# EAGLE design bldc (EAGLE 9.6.2)
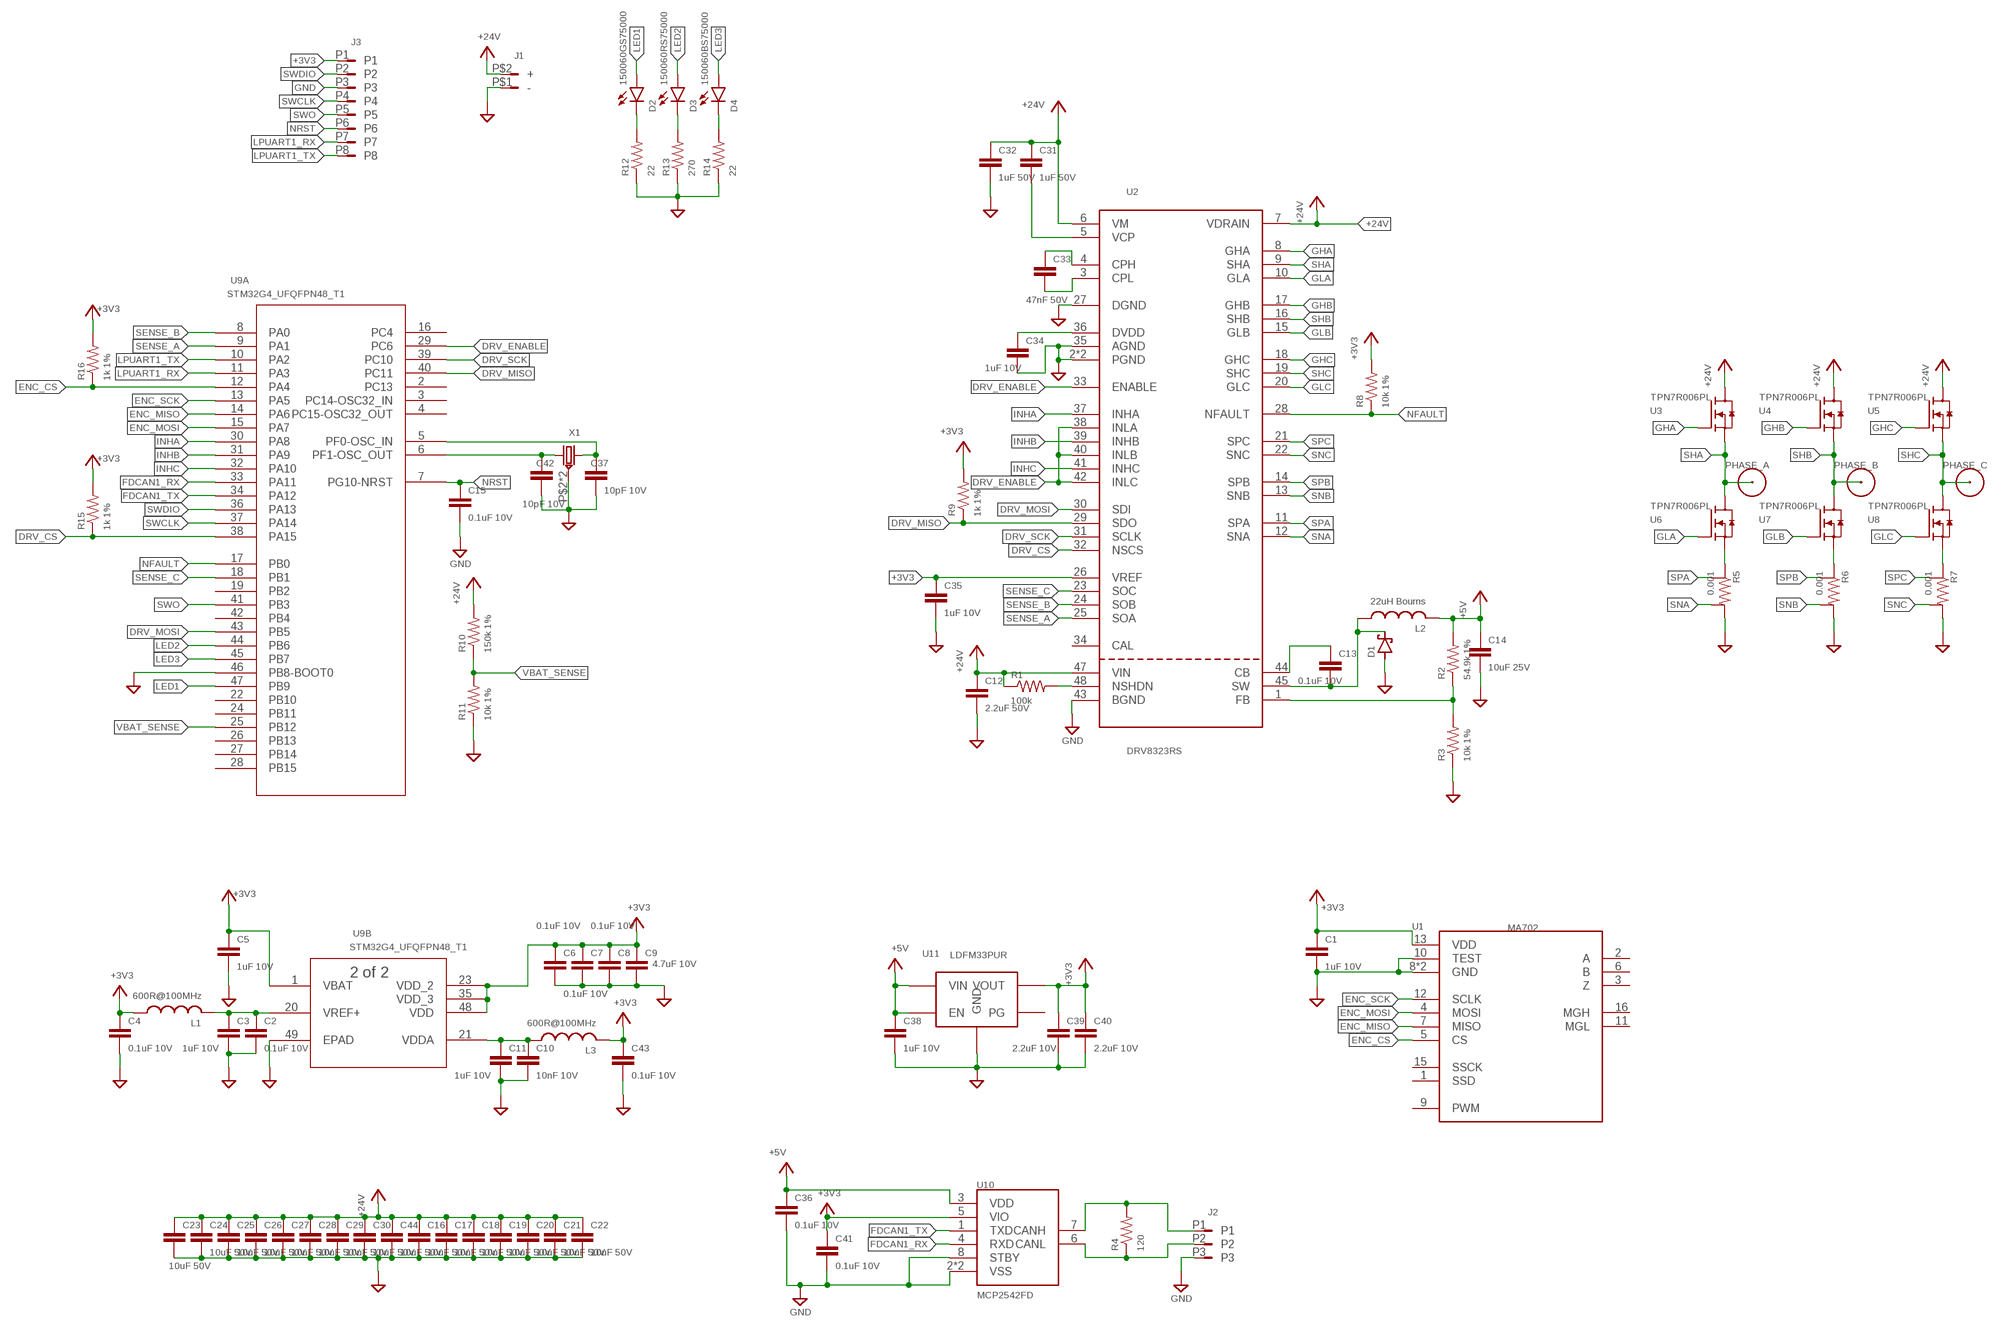
[diagram p0: schematic, sheet 1]

## Parts
C1  1uF 10V  C0402  [C0402]
C2  0.1uF 10V  C0402  [C0402]
C3  1uF 10V  C0402  [C0402]
C4  0.1uF 10V  C0402  [C0402]
C5  1uF 10V  C0402  [C0402]
C6  0.1uF 10V  C0402  [C0402]
C7  0.1uF 10V  C0402  [C0402]
C8  0.1uF 10V  C0402  [C0402]
C9  4.7uF 10V  C0402  [C0402]
C10  10nF 10V  C0402  [C0402]
C11  1uF 10V  C0402  [C0402]
C12  2.2uF 50V  C0603  [C0603]
C13  0.1uF 10V  C0402  [C0402]
C14  10uF 25V  C0603  [C0603]
C15  0.1uF 10V  C0402  [C0402]
C16  10uF 50V  C1206  [C1206]
C17  10uF 50V  C1206  [C1206]
C18  10uF 50V  C1206  [C1206]
C19  10uF 50V  C1206  [C1206]
C20  10uF 50V  C1206  [C1206]
C21  10uF 50V  C1206  [C1206]
C22  10uF 50V  C1206  [C1206]
C23  10uF 50V  C1206  [C1206]
C24  10uF 50V  C1206  [C1206]
C25  10uF 50V  C1206  [C1206]
C26  10uF 50V  C1206  [C1206]
C27  10uF 50V  C1206  [C1206]
C28  10uF 50V  C1206  [C1206]
C29  10uF 50V  C1206  [C1206]
C30  10uF 50V  C1206  [C1206]
C31  1uF 50V  C0603  [C0603]
C32  1uF 50V  C0603  [C0603]
C33  47nF 50V  C0402  [C0402]
C34  1uF 10V  C0402  [C0402]
C35  1uF 10V  C0402  [C0402]
C36  0.1uF 10V  C0402  [C0402]
C37  10pF 10V  C0402  [C0402]
C38  1uF 10V  C0402  [C0402]
C39  2.2uF 10V  C0402  [C0402]
C40  2.2uF 10V  C0402  [C0402]
C41  0.1uF 10V  C0402  [C0402]
C42  10pF 10V  C0402  [C0402]
C43  0.1uF 10V  C0402  [C0402]
C44  10uF 50V  C1206  [C1206]
D1  SCHOTTKY_SOD123  [SOD123]
D2  150060GS75000  LED_0603  [D0603]
D3  150060RS75000  LED_0603  [D0603]
D4  150060BS75000  LED_0603  [D0603]
J1  PWR_2_XT30PW-M  [XT30PW-M]
J2  LINEAR_35040500391  [MOLEX_5040500391]
J3  LINEAR_8530480810  [MOLEX_530480810]
L1  600R@100MHz  DC_CHOKE_FERRITE_BEAD_0603  [L0603]
L2  22uH Bourns  L_SDR0302  [SDR0302]
L3  600R@100MHz  DC_CHOKE_FERRITE_BEAD_0603  [L0603]
PHASE_A  WIRE_HOLE_AWG_18  [AWG_18]
PHASE_B  WIRE_HOLE_AWG_18  [AWG_18]
PHASE_C  WIRE_HOLE_AWG_18  [AWG_18]
R1  100k  R0402  [R0402]
R2  54.9k 1%  R0402  [R0402]
R3  10k 1%  R0402  [R0402]
R4  120  R0402  [R0402]
R5  0.001  R_SENSE_1210  [R1210_KELVIN]
R6  0.001  R_SENSE_1210  [R1210_KELVIN]
R7  0.001  R_SENSE_1210  [R1210_KELVIN]
R8  10k 1%  R0402  [R0402]
R9  1k 1%  R0402  [R0402]
R10  150k 1%  R0402  [R0402]
R11  10k 1%  R0402  [R0402]
R12  22  R0402  [R0402]
R13  270  R0402  [R0402]
R14  22  R0402  [R0402]
R15  1k 1%  R0402  [R0402]
R16  1k 1%  R0402  [R0402]
U1  MA702  [QFN-16_3X3]
U2  DRV8323RS  [VQFN-48_7X7]
U3  TPN7R006PL  [2-3X1S-TSONADVANCE]
U4  TPN7R006PL  [2-3X1S-TSONADVANCE]
U5  TPN7R006PL  [2-3X1S-TSONADVANCE]
U6  TPN7R006PL  [2-3X1S-TSONADVANCE]
U7  TPN7R006PL  [2-3X1S-TSONADVANCE]
U8  TPN7R006PL  [2-3X1S-TSONADVANCE]
U9  STM32G4_UFQFPN48_T1  [UFQFPN-48_7X7X0P55MM]
U10  MCP2542FD  [TDFN_2X3]
U11  LDFM33PUR  [DFN6_2X2]
X1  CRYSTAL_NX2016SA-24MHZ-EXS00A-CS11335  [NX201SA]

## Nets
3.3V30MA: C34.1 U2.36(DVDD)
+3V3 [midcurrent]: C1.1 C4.1 C5.1 C6.1 C7.1 C8.1 C9.1 C35.1 C39.1 C40.1 C41.1 C43.1 J3.P1 L1.1 L3.2 R8.2 R9.2 R15.2 R16.2 U1.13(VDD) U2.26(VREF) U9.1(B:VBAT) U9.23(B:VDD_2) U9.35(B:VDD_3) U9.48(B:VDD) U10.5(VIO) U11.PIN1(VOUT)
+5V [midcurrent]: C14.1 C36.1 C38.1 L2.PIN2 R2.2 U10.3(VDD) U11.PIN5(EN) U11.PIN6(VIN)
+24V [HighCurrent]: C12.1 C16.1 C17.1 C18.1 C19.1 C20.1 C21.1 C22.1 C23.1 C24.1 C25.1 C26.1 C27.1 C28.1 C29.1 C30.1 C31.1 C32.1 C44.1 J1.P$2(+) R1.1 R10.2 U2.6(VM) U2.7(VDRAIN) U2.47(VIN) U3.DRAIN(D) U4.DRAIN(D) U5.DRAIN(D)
DRV_CS: R15.1 U2.32(NSCS) U9.38(A:PA15)
DRV_ENABLE: U2.33(ENABLE) U2.38(INLA) U2.40(INLB) U2.42(INLC) U9.29(A:PC6)
DRV_MISO: R9.1 U2.29(SDO) U9.40(A:PC11)
DRV_MOSI: U2.30(SDI) U9.43(A:PB5)
DRV_SCK: U2.31(SCLK) U9.39(A:PC10)
ENC_CS: R16.1 U1.5(CS) U9.12(A:PA4)
ENC_MISO: U1.7(MISO) U9.14(A:PA6)
ENC_MOSI: U1.4(MOSI) U9.15(A:PA7)
ENC_SCK: U1.12(SCLK) U9.13(A:PA5)
FDCAN1_RX: U9.33(A:PA11) U10.4(RXD)
FDCAN1_TX: U9.34(A:PA12) U10.1(TXD)
GHA: U2.8(GHA) U3.GATE(G)
GHB: U2.17(GHB) U4.GATE(G)
GHC: U2.18(GHC) U5.GATE(G)
GLA: U2.10(GLA) U6.GATE(G)
GLB: U2.15(GLB) U7.GATE(G)
GLC: U2.20(GLC) U8.GATE(G)
GND: C1.2 C2.2 C3.2 C4.2 C5.2 C6.2 C7.2 C8.2 C9.2 C10.2 C11.2 C12.2 C14.2 C15.2 C16.2 C17.2 C18.2 C19.2 C20.2 C21.2 C22.2 C23.2 C24.2 C25.2 C26.2 C27.2 C28.2 C29.2 C30.2 C32.2 C34.2 C35.2 C36.2 C37.2 C38.2 C39.2 C40.2 C41.2 C42.2 C43.2 C44.2 D1.A J1.P$1(-) J2.P3 J3.P3 R3.1 R5.2A R5.2B R6.2A R6.2B R7.2A R7.2B R11.1 R12.1 R13.1 R14.1 U1.8(GND) U1.10(TEST) U1.PAD(GND) U2.2(PGND) U2.27(DGND) U2.35(AGND) U2.43(BGND) U2.PAD(PGND) U9.46(A:PB8-BOOT0) U9.49(B:EPAD) U10.2(VSS) U10.8(STBY) U10.PAD(VSS) U11.PAD(GND) U11.PIN4(GND) X1.P$2(GND) X1.P$4(GND)
INHA: U2.37(INHA) U9.30(A:PA8)
INHB: U2.39(INHB) U9.31(A:PA9)
INHC: U2.41(INHC) U9.32(A:PA10)
LED1: D2.2(A) U9.47(A:PB9)
LED2: D3.2(A) U9.44(A:PB6)
LED3: D4.2(A) U9.45(A:PB7)
LPUART1_RX: J3.P7 U9.11(A:PA3)
LPUART1_TX: J3.P8 U9.10(A:PA2)
N$1: C2.1 C3.1 L1.2 U9.20(B:VREF+)
N$2: C37.1 U9.5(A:PF0-OSC_IN) X1.P$3
N$3: C42.1 U9.6(A:PF1-OSC_OUT) X1.P$1
N$4: D4.1(C) R14.2
N$5: R1.2 U2.48(NSHDN)
N$6: C13.1 U2.44(CB)
N$7: D3.1(C) R13.2
N$8 [HighCurrent]: C13.2 D1.C L2.PIN1 U2.45(SW)
N$9: R2.1 R3.2 U2.1(FB)
N$10: D2.1(C) R12.2
N$11: J2.P1 R4.2 U10.7(CANH)
N$12: J2.P2 R4.1 U10.6(CANL)
N$13: C31.2 U2.5(VCP)
N$14: C33.1 U2.4(CPH)
N$15: C33.2 U2.3(CPL)
N$16 [midcurrent]: C10.1 C11.1 L3.1 U9.21(B:VDDA)
N$21: R7.1A R7.1B U8.SOURCE(S) U8.SOURCE@1(S) U8.SOURCE@2(S)
N$22: R6.1A R6.1B U7.SOURCE(S) U7.SOURCE@1(S) U7.SOURCE@2(S)
N$23: R5.1A R5.1B U6.SOURCE(S) U6.SOURCE@1(S) U6.SOURCE@2(S)
NFAULT: R8.1 U2.28(NFAULT) U9.17(A:PB0)
NRST: C15.1 J3.P6 U9.7(A:PG10-NRST)
SENSE_A: U2.25(SOA) U9.9(A:PA1)
SENSE_B: U2.24(SOB) U9.8(A:PA0)
SENSE_C: U2.23(SOC) U9.18(A:PB1)
SHA: PHASE_A.PIN1(P1) U2.9(SHA) U3.SOURCE(S) U3.SOURCE@1(S) U3.SOURCE@2(S) U6.DRAIN(D)
SHB: PHASE_B.PIN1(P1) U2.16(SHB) U4.SOURCE(S) U4.SOURCE@1(S) U4.SOURCE@2(S) U7.DRAIN(D)
SHC: PHASE_C.PIN1(P1) U2.19(SHC) U5.SOURCE(S) U5.SOURCE@1(S) U5.SOURCE@2(S) U8.DRAIN(D)
SNA: R5.2_KELVIN(K2) U2.12(SNA)
SNB: R6.2_KELVIN(K2) U2.13(SNB)
SNC: R7.2_KELVIN(K2) U2.22(SNC)
SPA: R5.1_KELVIN(K1) U2.11(SPA)
SPB: R6.1_KELVIN(K1) U2.14(SPB)
SPC: R7.1_KELVIN(K1) U2.21(SPC)
SWCLK: J3.P4 U9.37(A:PA14)
SWDIO: J3.P2 U9.36(A:PA13)
SWO: J3.P5 U9.41(A:PB3)
VBAT_SENSE: R10.1 R11.2 U9.25(A:PB12)
Unconnected: J1.P$3(GND) J1.P$4(GND) J2.MNT@1(GND) J2.MNT@2(GND) U1.1(SSD) U1.2(A) U1.3(Z) U1.6(B) U1.9(PWM) U1.11(MGL) U1.14(NC) U1.15(SSCK) U1.16(MGH) U2.34(CAL) U2.46(NC) U9.2(A:PC13) U9.3(A:PC14-OSC32_IN) U9.4(A:PC15-OSC32_OUT) U9.16(A:PC4) U9.19(A:PB2) U9.22(A:PB10) U9.24(A:PB11) U9.26(A:PB13) U9.27(A:PB14) U9.28(A:PB15) U9.42(A:PB4) U11.PIN3(PG)

## Library data of the parts
C1-C43 = _T_rcl:C
C44 = _T_rcl:C; BOM: C3216X7R1H106K160AE
D1 = _T_rcl:SCHOTTKY
D2-D4 = _T_rcl:LED
J1 = _T_conn:PWR_2
J2 = _T_conn:LINEAR_3
J3 = _T_conn:LINEAR_8
L1 L3 = _T_rcl:DC_CHOKE
L2 = _T_rcl:L
PHASE_A PHASE_B PHASE_C = _T_conn:WIRE_HOLE
R1-R4 R8-R16 = _T_rcl:R
R5-R7 = _T_rcl:R_SENSE
U1 = _T_ic:MA702; DATASHEET: https://www.monolithicpower.com/en/documentview/productdocument/index/version/2/document_type/Datasheet/lang/en/sku/MA702/
U2 = _T_ic:DRV8323RS; DATASHEET: https://www.ti.com/lit/ds/symlink/drv8323r.pdf?ts=1587957100782
U3-U8 = _T_transistors:TPN7R006PL
U9 = _T_ic:STM32G4_UFQFPN48_T1; BUILT_BY: EMA_Jessica; COPYRIGHT: Copyright (C) 2016 Accelerated Designs. All rights reserved; MANUFACTURER_PART_NUMBER: stm32g4_ufqfpn48_t1; VENDOR: STMicroelectronics
U10 = _T_ic:MCP2542FD
U11 = _T_ic:LDFM
X1 = _T_ic:CRYSTAL

## Net classes
0 default: width 0.2 mm, drill 0.3 mm, clearance 0.152 mm
1 Smallsig: width 0.2 mm, drill 0.3 mm, clearance 0.152 mm
2 HighCurrent: width 0.35 mm, drill 0.3 mm, clearance 0.203 mm
3 midcurrent: width 0.25 mm, drill 0.3 mm, clearance 0.178 mm

## Board
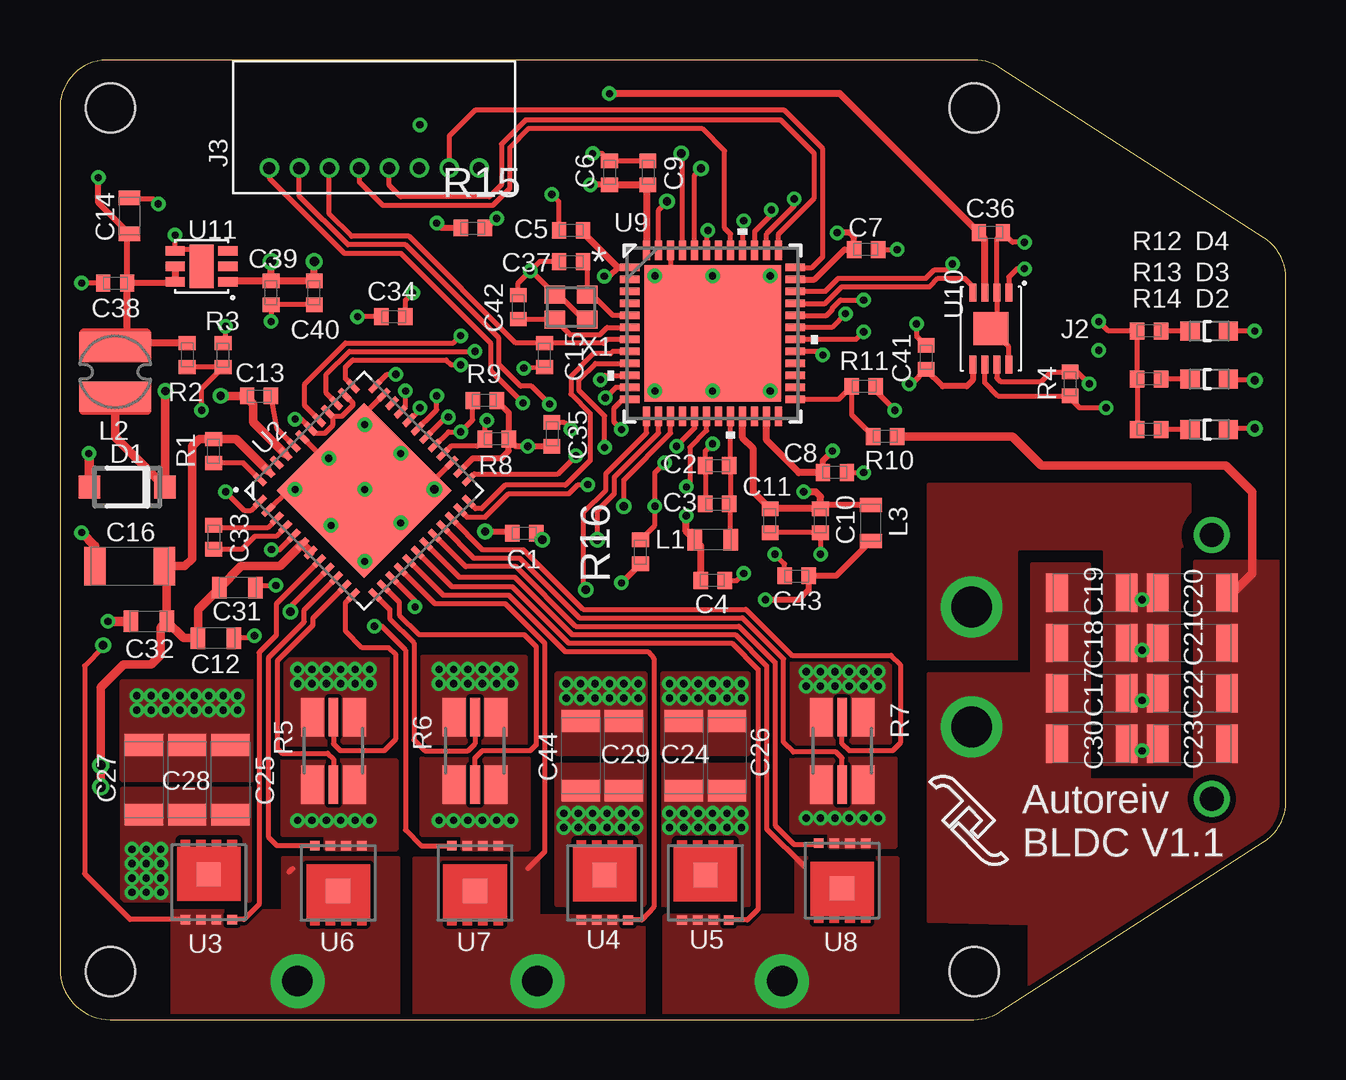
[diagram p1: board, top side]
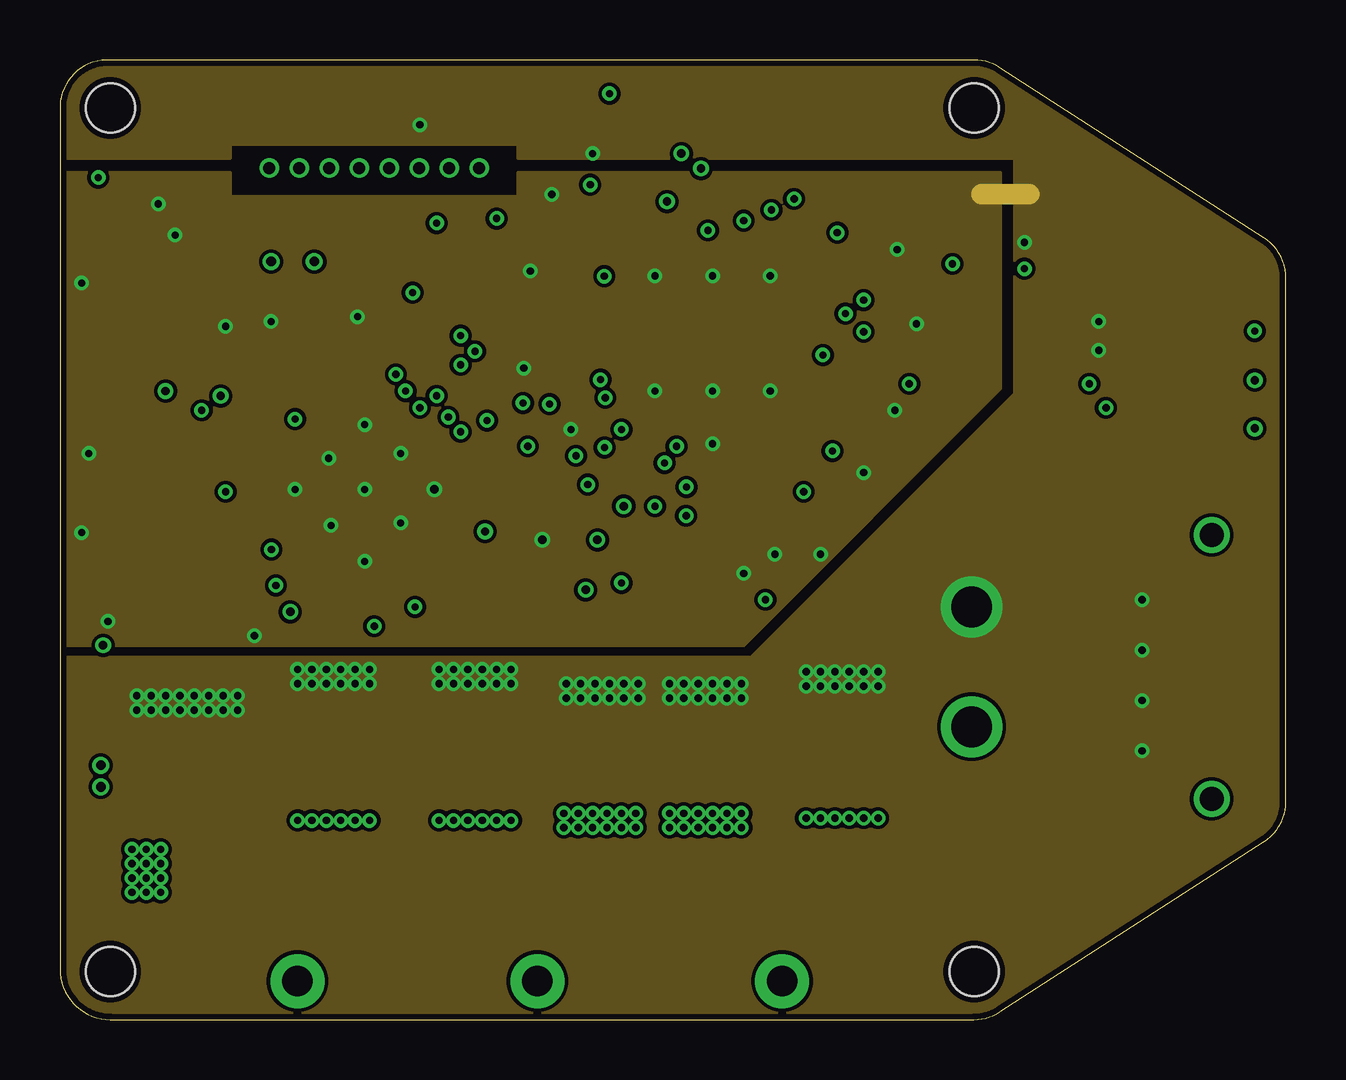
[diagram p2: board, inner layer Route2]
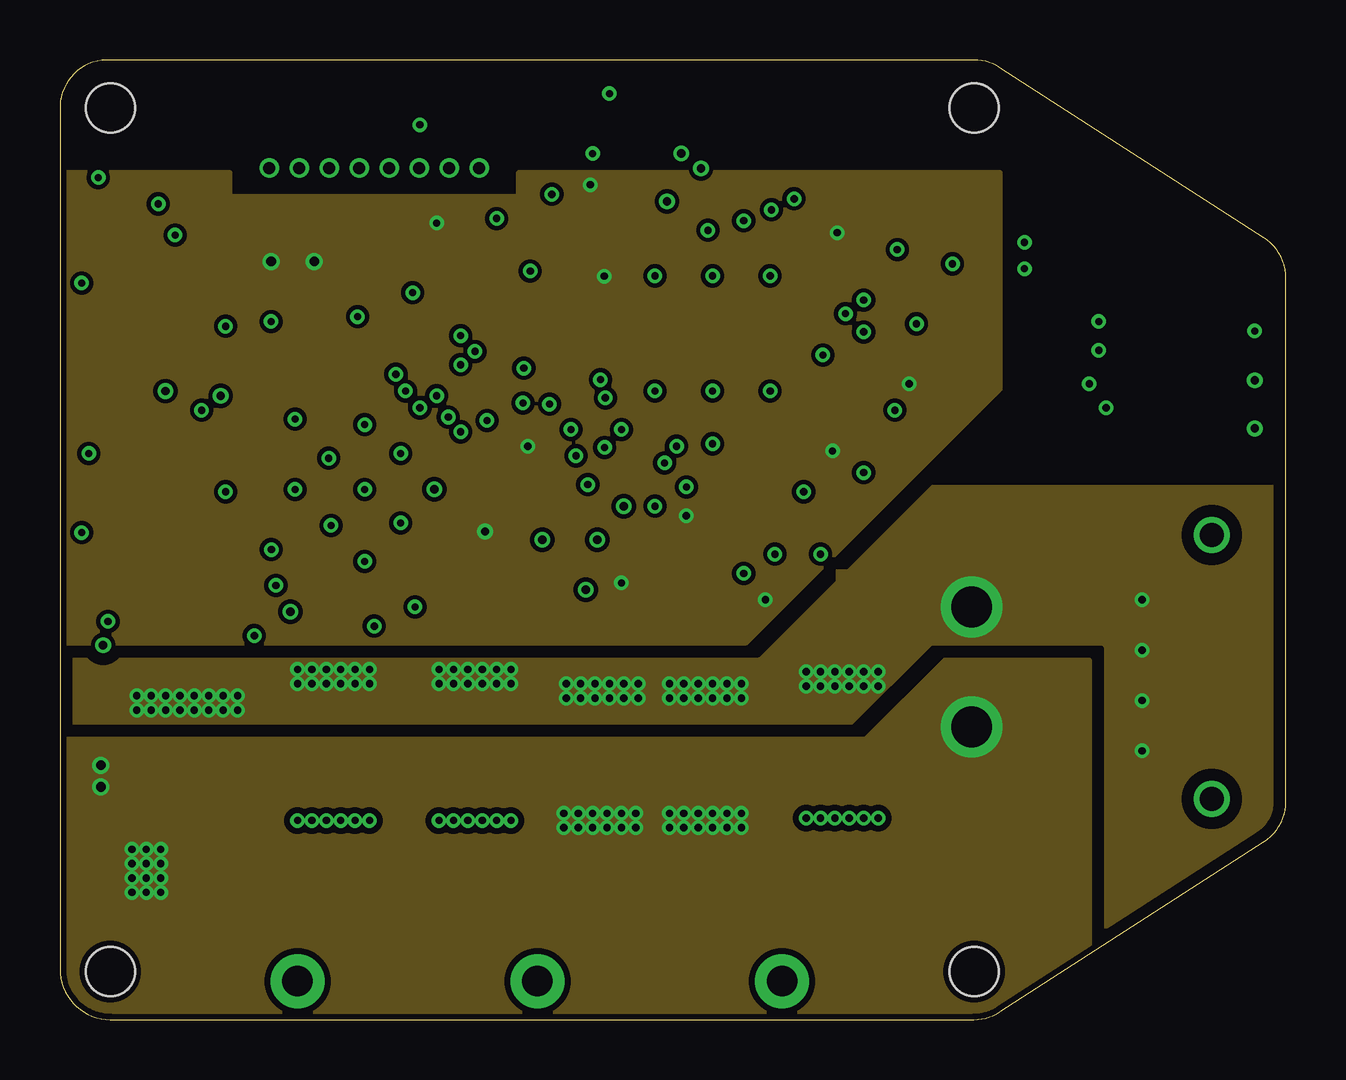
[diagram p3: board, inner layer Route15]
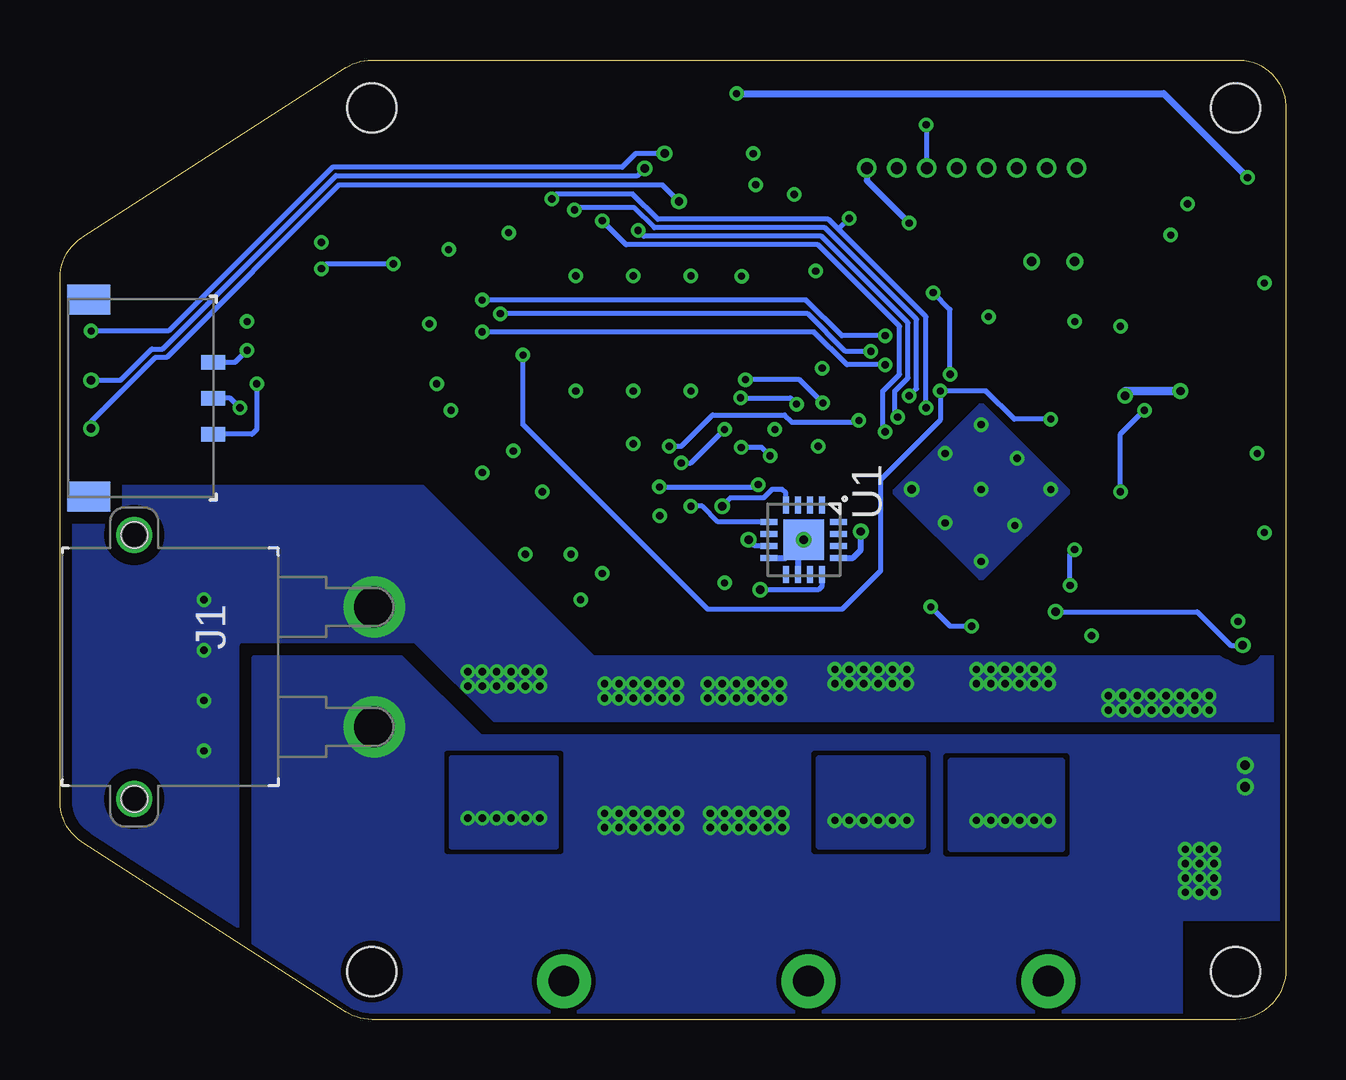
[diagram p4: board, bottom side, seen from below]

Size 51.1 x 40 mm. Coordinates in mm from the lower left corner, seen from the top.
Outline: 39.18,39.68 arc33 38.1,40 2.1,40 arc90 0,38.1 0,2.1 arc90 2.1,0 38.1,0 arc33 39.18,0.32 50.18,7.41 arc57 51.1,9.09 51.1,30.91 arc57 50.18,32.59 39.18,39.68
Copper layers (1*2*15*16): Top 0.035mm / dielectric 0.11mm / Route2 0.035mm / dielectric 1.31mm / Route15 0.035mm / dielectric 0.11mm / Bottom 0.035mm
Design rules "pcbway_4_layer *": minimum track width 6mil, minimum drill 0.29mm, track to track 6mil, track to pad 6mil, pad to pad 6mil, via to via 6mil, smd to smd 0mil, copper to edge 0.25mm, drill to drill 10mil, minimum pad ring 6mil, minimum via ring 6mil, stop-mask expansion 2mil, vias tented up to drill 0mil, thermal gap 10mil
Holes 2.05 mm at 2.1,38 38.1,38 38.1,2 2.1,2

### Footprints (pad centres in the part's own frame; a part is rotated, then mirrored left to right if it is on the bottom)
C0402 = smd 0.6 x 0.7: 1 0.5,0; 2 -0.5,0
C0603 = smd 0.6 x 0.9: 1 0.75,0; 2 -0.75,0
C1206 = smd 0.9 x 1.6: 1 1.45,0; 2 -1.45,0
SOD123 = smd 0.9 x 0.95: A 1.575,0; C -1.575,0
D0603 = smd 0.8 x 0.8: 1 -0.8,0; 2 0.8,0
XT30PW-M = drill 1.7: P$1 -2.5,10; P$2 2.5,10 | drill 1: P$3 5.5,0; P$4 -5.5,0
MOLEX_5040500391 = smd 1.25 x 1.8: MNT@1 4.105,5.2; MNT@2 -4.105,5.2 | smd 0.6 x 1: P1 -1.5,0.01; P2 0,0.01; P3 1.5,0.01
MOLEX_530480810 = drill 0.5: P1 4.375,0; P2 3.125,0; P3 1.875,0; P4 0.625,0; P5 -0.625,0; P6 -1.875,0; P7 -3.125,0; P8 -4.375,0
L0603 = smd 0.6 x 0.9: 1 0.75,0; 2 -0.75,0
SDR0302 = smd 3 x 1.25: PIN1 0,1.025; PIN2 0,-1.025
AWG_18 = drill 1.28 pad 2.25: PIN1 0,0
R0402 = smd 0.6 x 0.7: 1 0.5,0; 2 -0.5,0
R1210_KELVIN = smd 1.6 x 0.4: 1_KELVIN -1.4,0; 2_KELVIN 1.4,0 | smd 1.6 x 0.95: 1A -1.4,0.875; 1B -1.4,-0.875; 2A 1.4,0.875; 2B 1.4,-0.875
QFN-16_3X3 = smd 0.7 x 0.25: 1 -1.45,0.75; 2 -1.45,0.25; 3 -1.45,-0.25; 4 -1.45,-0.75; 9 1.45,-0.75; 10 1.45,-0.25; 11 1.45,0.25; 12 1.45,0.75 | smd 0.25 x 0.7: 5 -0.75,-1.45; 6 -0.25,-1.45; 7 0.25,-1.45; 8 0.75,-1.45; 13 0.75,1.45; 14 0.25,1.45; 15 -0.25,1.45; 16 -0.75,1.45 | smd 1.7 x 1.7: PAD 0,0
VQFN-48_7X7 = smd 0.6 x 0.24: 1 -3.4,2.75; 2 -3.4,2.25; 3 -3.4,1.75; 4 -3.4,1.25; 5 -3.4,0.75; 6 -3.4,0.25; 7 -3.4,-0.25; 8 -3.4,-0.75; 9 -3.4,-1.25; 10 -3.4,-1.75; 11 -3.4,-2.25; 12 -3.4,-2.75; 25 3.4,-2.75; 26 3.4,-2.25; 27 3.4,-1.75; 28 3.4,-1.25; 29 3.4,-0.75; 30 3.4,-0.25; 31 3.4,0.25; 32 3.4,0.75; 33 3.4,1.25; 34 3.4,1.75; 35 3.4,2.25; 36 3.4,2.75 | smd 0.24 x 0.6: 13 -2.75,-3.4; 14 -2.25,-3.4; 15 -1.75,-3.4; 16 -1.25,-3.4; 17 -0.75,-3.4; 18 -0.25,-3.4; 19 0.25,-3.4; 20 0.75,-3.4; 21 1.25,-3.4; 22 1.75,-3.4; 23 2.25,-3.4; 24 2.75,-3.4; 37 2.75,3.4; 38 2.25,3.4; 39 1.75,3.4; 40 1.25,3.4; 41 0.75,3.4; 42 0.25,3.4; 43 -0.25,3.4; 44 -0.75,3.4; 45 -1.25,3.4; 46 -1.75,3.4; 47 -2.25,3.4; 48 -2.75,3.4 | smd 5.15 x 5.15: PAD 0,0
2-3X1S-TSONADVANCE = smd 1 x 1: DRAIN 0.005,0.33 | smd 0.4 x 0.4: GATE 0.975,-1.55; SOURCE -0.975,-1.55; SOURCE@1 -0.325,-1.55; SOURCE@2 0.325,-1.55
UFQFPN-48_7X7X0P55MM = smd 0.813 x 0.305: 1 -3.454,2.75; 2 -3.454,2.25; 3 -3.454,1.75; 4 -3.454,1.25; 5 -3.454,0.75; 6 -3.454,0.25; 7 -3.454,-0.25; 8 -3.454,-0.75; 9 -3.454,-1.25; 10 -3.454,-1.75; 11 -3.454,-2.25; 12 -3.454,-2.75; 25 3.454,-2.75; 26 3.454,-2.25; 27 3.454,-1.75; 28 3.454,-1.25; 29 3.454,-0.75; 30 3.454,-0.25; 31 3.454,0.25; 32 3.454,0.75; 33 3.454,1.25; 34 3.454,1.75; 35 3.454,2.25; 36 3.454,2.75 | smd 0.305 x 0.813: 13 -2.75,-3.454; 14 -2.25,-3.454; 15 -1.75,-3.454; 16 -1.25,-3.454; 17 -0.75,-3.454; 18 -0.25,-3.454; 19 0.25,-3.454; 20 0.75,-3.454; 21 1.25,-3.454; 22 1.75,-3.454; 23 2.25,-3.454; 24 2.75,-3.454; 37 2.75,3.454; 38 2.25,3.454; 39 1.75,3.454; 40 1.25,3.454; 41 0.75,3.454; 42 0.25,3.454; 43 -0.25,3.454; 44 -0.75,3.454; 45 -1.25,3.454; 46 -1.75,3.454; 47 -2.25,3.454; 48 -2.75,3.454 | smd 5.69 x 5.69: 49 0,0
TDFN_2X3 = smd 0.3 x 0.75: 1 -0.75,-1.5; 2 -0.25,-1.5; 3 0.25,-1.5; 4 0.75,-1.5; 5 0.75,1.5; 6 0.25,1.5; 7 -0.25,1.5; 8 -0.75,1.5 | smd 1.46 x 1.36: PAD 0,0
DFN6_2X2 = smd 1.8 x 1: PAD 0,0 | smd 0.4 x 0.8: PIN1 0.65,1.1; PIN2 0,1.1; PIN3 -0.65,1.1; PIN4 -0.65,-1.1; PIN5 0,-1.1; PIN6 0.65,-1.1
NX201SA = smd 0.85 x 0.75: P$1 -0.675,-0.525; P$2 0.675,-0.525; P$3 0.675,0.525; P$4 -0.675,0.525

### Placement (x,y rotation side)
C1  19.36,20.27 180 top
C2  27.4,23.1 0 top
C3  27.4,21.5 0 top
C4  27.2,18.3 180 top
C5  21.3,32.9 0 top
C6  22.9,35.3 270 top
C7  33.6,32.1 180 top
C8  32.3,22.8 180 top
C9  24.5,35.3 270 top
C10  31.7,20.8 90 top
C11  29.6,20.8 90 top
C12  6.5,15.9 180 top
C13  8.3,26 0 top
C14  2.9,33.5 270 top
C15  20.2,27.7 90 top
C16  2.9,18.9 0 top
C17  43,13.6 180 top
C18  43,15.7 180 top
C19  43,17.8 180 top
C20  47.2,17.8 0 top
C21  47.2,15.7 0 top
C22  47.2,13.6 0 top
C23  47.2,11.5 0 top
C24  26,11 270 top
C25  7.1,10 270 top
C26  27.8,11 270 top
C27  3.5,10 270 top
C28  5.3,10 270 top
C29  23.5,11 270 top
C30  43,11.5 180 top
C31  7.4,18 180 top
C32  3.7,16.6 0 top
C33  6.4,20.1 270 top
C34  13.9,29.3 0 top
C35  20.5,24.4 270 top
C36  38.8,32.8 180 top
C37  21.3,31.6 0 top
C38  2.3,30.7 0 top
C39  8.8,30.3 90 top
C40  10.6,30.3 90 top
C41  36.1,27.6 270 top
C42  19.1,29.7 270 top
C43  30.7,18.5 0 top
C44  21.7,11 270 top
D1  2.8,22.2 180 top
D2  47.9,24.6 0 top
D3  47.9,26.7 0 top
D4  47.9,28.7 0 top
J1  48,14.7 270 bottom
J2  44.7,25.9 90 bottom
J3  13.1,35.5 0 top
L1  27.2,20 180 top
L2  2.3,27 180 top
L3  33.8,20.7 90 top
PHASE_A  9.9,1.6 0 top
PHASE_B  19.9,1.6 0 top
PHASE_C  30.1,1.6 0 top
R1  6.4,23.7 90 top
R2  5.3,27.7 270 top
R3  6.8,27.7 90 top
R4  42.1,26.5 270 top
R5  11.4,11.2 90 top
R6  17.3,11.2 90 top
R7  32.6,11.2 90 top
R8  18.2,24.2 180 top
R9  17.7,25.8 180 top
R10  34.4,24.3 180 top
R11  33.5,26.4 0 top
R12  45.4,24.6 180 top
R13  45.4,26.7 180 top
R14  45.4,28.7 180 top
R15  17.2,33 0 top
R16  24.2,19.5 90 top
U1  20.1,20 270 bottom
U2  12.68,22.05 45 top
U3  6.2,5.72 0 top
U4  22.7,5.7 0 top
U5  26.9,5.7 0 top
U6  11.6,5.7 180 top
U7  17.3,5.7 180 top
U8  32.6,5.8 180 top
U9  27.2,28.6 0 top
U10  38.8,28.8 180 top
U11  5.9,31.4 270 top
X1  21.3,29.7 0 top

### Tracks (layer width: path | path; a pad name or v marks a point on that pad's centre or on a via)
3.3V30MA  (via drill 0.3)
  Top 0.2: U2.36 13.64,26.9 v14,26.9 | C34.1 14.4,30 v14.7,30.3
  Bottom 0.2: v14,26.9 14,29.6 v14.7,30.3
+3V3  (via drill 0.3, 0.35, 0.4)
  Top 0.25: U9.35 31.45,30.85 32.7,32.1 C7.1 33.1,32.6 32.9,32.8 v32.4,32.8 | C6.1 v22.1,34.8 | C8.1 31.8,23.3 v32.2,23.7 | v17.72,20.34 18.79,20.34 C1.1 | U2.26 17.21,23.4 18.4,23.4 18.7,23.7 R8.2 | R8.2 19,23.9 v19.5,23.9 C35.1 | R9.2 18.7,25.3 R8.2 | L3.2 32.35,18.5 C43.1 31.2,17.9 30.8,17.5 v29.4,17.5 | 23.25,31.35 22.89,30.99 v22.69,30.99 | U10.5 38.05,26.65 37.8,26.4 36.8,26.4 C41.1 35.5,26.5 v35.4,26.5 | R15.2 15.9,33 v15.7,33.2 | R16.2 v23.4,18.2
  Top 0.3: U11.PIN1 7.05,30.8 C39.1 | C39.1 C40.1 v10.6,31.6 | C39.1 v8.8,31.6 | U9.1 23.25,31.35 21.8,32.8 C5.1 | 22.95,34.75 C6.1 C9.1 24.45,34.75 U9.48 | C8.1 30.8,22.8 29.45,24.15 U9.23 | v26.1,21 26.1,20.35 L1.1 26.7,19.75 C4.1
  Bottom 0.25: v17.72,20.34 17.72,19.58 18.05,19.25 U1.13 | J3.P1 17.48,34.98 v15.7,33.2
  pour Route15: -0.6,15.7 28.6,15.7 39.2,26.3 39.2,35.3 19.1,35.3 19.1,34.3 7.1,34.3 7.1,35.3 -0.6,35.3
+5V  (via drill 0.3)
  Top 0.25: v1.6,35.1 1.6,34.05 C14.1 2.85,32.75 2.8,32.7 C38.1 4.75,30.7 U11.PIN6
  Top 0.3: C38.1 2.8,28.52 L2.PIN2 2.48,28.2 R2.2 | U11.PIN5 U11.PIN6 | U10.3 38.55,32.55 C36.1 32.5,38.6 v22.9,38.6
  Bottom 0.3: v22.9,38.6 5.1,38.6 v1.6,35.1
+24V  (via drill 0.3, 0.4)
  Top 0.35: C32.1 4.45,18.8 C16.1 5.2,18.9 5.5,19.2 5.5,23.9 5.8,24.2 R1.1 7.35,24.2 U2.47 | C32.1 5.15,15.9 C12.1 5.75,17.1 C31.1 7.55,18.9 9.18,18.9 U2.6 U2.7 | C32.1 4.2,16.35 4.2,15.2 3.8,14.8 2.65,14.8 1.7,13.85 v1.7,10.6 v1.7,9.7 | R10.2 39.7,24.3 40.9,23.1 48.6,23.1 49.7,22 49.7,18.6 48.9,17.8 C20.1
  other vias: 3,5.3 3,5.9 3,6.5 3,7.1 3.6,5.3 3.6,5.9 3.6,6.5 3.6,7.1 4.2,5.3 4.2,5.9 4.2,6.5 4.2,7.1 24,8 24,8.6 23.4,8.6 23.4,8 22.8,8 22.8,8.6 22.2,8.6 22.2,8 21.6,8 21.6,8.6 27.8,8 27.8,8.6 27.2,8.6 27.2,8 26.6,8 26.6,8.6 26,8.6 26,8 25.4,8 25.4,8.6 28.4,8 28.4,8.6 21,8 21,8.6
  pour Top (isolate 0.25, no thermals): 36.2,14.4 40.5,14.4 40.5,19 42.9,19 42.9,10 47.3,10 47.3,19.1 51.9,19.1 51.9,-0.6 40.4,-0.6 40.4,4 36.2,4.1
  pour Top (no thermals): 2.6,5 8.1,5 8.1,9.6 2.6,9.6
  pour Top (no thermals): 20.7,4.8 24.4,4.8 24.4,10.6 20.7,10.6
  pour Top (no thermals): 25.1,4.8 28.7,4.8 28.7,10.6 25.1,10.6
  pour Route15 (isolate 0.25, no thermals): -0.4,11.7 33.6,11.7 36.9,15 42.9,15 42.9,-0.8 -0.4,-0.8
  pour Bottom (rank 2, no thermals): 4.4,-1.2 43,-1.2 43,15.1 36.9,15.1 33.6,11.8 -0.3,11.8 -0.3,4.2 4.4,4.2
DRV_CS  (via drill 0.3)
  Top 0.2: U2.32 15,25.43 v15,25.5 | U9.38 29.45,32.76 30.6,33.91 v30.6,34.21 | R15.1 17.81,33 v18.2,33.39
  Bottom 0.2: 18.65,32.95 15,29.3 v15,25.5 | 18.65,32.95 19.06,33.36 26.18,33.36 27.23,34.41 30.4,34.41 v30.6,34.21 | v18.2,33.39 18.65,32.95
DRV_ENABLE  (via drill 0.3)
  Top 0.2: U2.33 14.4,25.54 v14.4,26.2 | U2.38 12.2,25.71 12.2,25.6 11.74,25.14 11.36,25.14 | U2.40 11.36,25.14 | 11.36,25.14 11.36,24.75 11.04,24.43 10.65,24.43 U2.42 10.05,25.03 v9.8,25.03 | v31.8,27.7 31.65,27.85 U9.29
  Bottom 0.2: v9.8,25.03 11.33,25.03 12.5,26.2 v14.4,26.2 14.4,25 16.9,22.5 16.9,18.7 18.5,17.1 24.1,17.1 31.8,24.8 v31.8,27.7
DRV_MISO  (via drill 0.3)
  Top 0.2: U2.29 16.19,24.5 v16.7,24.5 17.2,25 R9.1 | v28.5,33.3 28.45,33.25 U9.40
  Bottom 0.2: v16.7,24.5 16.8,24.6 16.8,26.2 16.11,26.89 16.11,28.91 19.5,32.3 27.5,32.3 v28.5,33.3
DRV_MOSI  (via drill 0.3)
  Top 0.2: U2.30 16.1,25.11 v16.19,25.11 | v27.01,32.9 26.95,32.84 U9.43
  Bottom 0.2: v16.19,25.11 16.3,25.23 16.3,26.2 15.75,26.75 15.75,29.05 19.35,32.65 26.76,32.65 v27.01,32.9
DRV_SCK  (via drill 0.3)
  Top 0.2: U2.31 15.22,24.95 15.23,24.95 15.7,25.41 v15.7,26 | v29.65,33.75 29.65,33.55 28.95,32.85 U9.39
  Bottom 0.2: v15.7,26 15.4,26.3 15.4,29.2 19.21,33.01 26.33,33.01 27.18,33.85 29.45,33.85 29.55,33.75 v29.65,33.75
ENC_CS  (via drill 0.3)
  Top 0.2: v25.2,23.2 24.8,22.8 v24.8,21.4 24.8,20.6 R16.1 | v23.4,24.6 23.1,24.9 23.1,25.5 23.45,25.85 U9.12
  Bottom 0.2: v24.8,21.4 24.32,21.4 23.67,20.75 U1.5 | v25.2,23.2 24.8,23.2 v23.4,24.6
ENC_MISO  (via drill 0.35)
  Top 0.2: v22.4,20 22.4,21.22 23.11,21.92 23.11,22.61 24.95,24.45 U9.14
  Bottom 0.2: U1.7 22.15,19.75 v22.4,20
ENC_MOSI  (via drill 0.35)
  Top 0.2: v23.5,21.4 23.5,22.5 25.45,24.45 U9.15
  Bottom 0.2: U1.4 20.85,21.95 21,22.1 21.42,22.1 21.77,21.75 23.16,21.75 v23.5,21.4
ENC_SCK  (via drill 0.35)
  Top 0.2: v21.91,17.91 21.81,18.01 21.81,21.13 22.76,22.07 22.76,22.75 24.45,24.45 U9.13
  Bottom 0.2: U1.12 19.35,18.05 19.49,17.91 v21.91,17.91
FDCAN1_RX
  Top 0.2: U9.33 31.89,29.85 32.59,30.55 36.25,30.55 36.6,30.9 37.7,30.9 38.05,30.55 U10.4
FDCAN1_TX  (via drill 0.3)
  Top 0.2: U9.34 31.89,30.34 32.44,30.9 36.1,30.9 36.45,31.25 36.95,31.25 v37.2,31.5 | v40.2,31.3 39.9,31.3 39.55,30.95 U10.1
  Bottom 0.2: v37.2,31.5 40,31.5 v40.2,31.3
GHA
  Top 0.2: U3.GATE 7.67,4.17 8.29,4.79 8.29,15.29 9.02,16.02 9.02,17.33 U2.8
GHB
  Top 0.2: U4.GATE 24.25,4.15 24.75,4.7 24.75,15.05 24.51,15.34 21.06,15.34 18.7,17.7 15.97,17.7 U2.17
GHC
  Top 0.2: U2.18 16.33,18.05 18.85,18.05 21.2,15.69 28.01,15.69 29.1,14.6 29.1,4.6 28.65,4.15 U5.GATE
GLA
  Top 0.2: U6.GATE 9.05,7.25 8.7,7.6 8.7,15.1 10.18,16.58 10.18,17.07 U2.10
GLB  (via drill 0.3)
  Top 0.2: U2.15 14.8,17.45 v14.8,17.2 | v13.1,16.4 13.4,16.4 14.4,15.4 14.4,7.9 15.05,7.25 U7.GATE
  Bottom 0.2: v14.8,17.2 14,16.4 v13.1,16.4
GLC
  Top 0.2: U2.20 16.91,18.88 19.01,18.88 21.5,16.39 28.3,16.39 29.8,14.89 29.8,8.1 30.6,7.3 31.58,7.3 U8.GATE
GND  (via drill 0.3, 0.35)
  Top 0.2: X1.P$2 21.83,29.18 20.78,30.23 X1.P$4 19.65,31.2 v19.6,31.2 | C37.2 20,31.6 v19.6,31.2 | C42.2 19.1,30.7 v19.6,31.2 | C40.2 C39.2 v8.8,29.1 | R3.1 6.9,28.3 v6.9,28.9 | C34.2 v12.4,29.3 | C9.2 C6.2 22.6,36.1 v22.2,36.1 | C3.2 C2.2 26.9,23.7 v27.2,24 | C11.2 C10.2 v31.7,19.4 | C4.2 28.2,18.3 v28.5,18.6 | C7.2 v34.9,32.1 | C8.2 v33.5,22.8 | v4.1,34 3.9,34.2 2.95,34.2 C14.2 | C38.2 v0.9,30.7 | v4.8,32.7 U11.PIN4 4.85,32.1 5.8,32.1 5.8,31.5 U11.PAD | U10.8 39.55,28.05 38.9,28.7 | 38.9,28.7 U10.PAD | 38.9,28.7 39.05,28.85 U10.2 39.05,32.55 C36.2 39.7,32.4 v40.2,32.4 | R11.1 34,26.2 v34.8,25.4 | U9.49 v24.8,31 25.3,31 25.45,31.15 U9.46 | 1.23,23.57 v1.2,23.6 | v8.1,16 8,15.9 C12.2 | U2.35 12.7,25.25 v12.7,24.8 | U2.43 10.98,23.4 v11.2,23.4 | U2.2 9.55,22.1 v9.8,22.1 | U2.PAD 12.7,22.07 v12.7,22.1 | C35.2 21,24.9 v21.3,24.6 | U2.27 15.5,22.4 15.4,22.4 v14.2,23.6 | C15.2 19.55,27.15 v19.33,27.15 | C43.2 30.2,19 v29.8,19.4 | C41.2 35.7,28.5 v35.7,29 | R12.1 R13.1 R14.1 43.7,28.7 v43.3,29.1 | C5.2 20.8,34.1 v20.5,34.4
  Top 0.25: C1.2 19.86,20.24 U1.PAD
  Top 0.4: C16.2 1.45,19.75 v0.9,20.3 | C32.2 v2,16.6 | D1.A 1.23,23.57
  Route2 0.85: 38.4,34.4 40.4,34.4
  Bottom 0.2: J2.P3 43.8,27.4 v43.3,27.9 | J3.P3 14.97,37.27 v15,37.3
  Bottom 0.25: U1.10 20.35,19.75 U1.PAD 20.85,19.25 U1.8
  other vias: 45.1,17.5 45.1,15.4 45.1,13.3 45.1,11.2 18.8,14.6 18.8,14 18.2,14 18.2,14.6 17.6,14.6 17.6,14 17,14.6 17,14 16.4,14 16.4,14.6 15.8,14.6 15.8,14 12.9,14.6 12.9,14 12.3,14 12.3,14.6 11.7,14.6 11.7,14 11.1,14.6 11.1,14 10.5,14 10.5,14.6 9.9,14.6 9.9,14 28.4,14 28.4,13.4 27.8,13.4 27.8,14 27.2,14 27.2,13.4 26.6,14 26.6,13.4 26,13.4 26,14 25.4,14 25.4,13.4 24.1,14 24.1,13.4 23.5,13.4 23.5,14 22.9,14 22.9,13.4 22.3,14 22.3,13.4 21.7,13.4 21.7,14 21.1,14 21.1,13.4 34.1,14.5 34.1,13.9 33.5,13.9 33.5,14.5 32.9,14.5 32.9,13.9 32.3,14.5 32.3,13.9 31.7,13.9 31.7,14.5 31.1,14.5 31.1,13.9 3.8,12.9 3.8,13.5 3.2,13.5 3.2,12.9 7.4,13.5 7.4,12.9 6.8,12.9 6.8,13.5 6.2,13.5 6.2,12.9 5.6,13.5 5.6,12.9 5,12.9 5,13.5 4.4,13.5 4.4,12.9 14.2,20.7 12.7,19.1 11.3,20.6 27.2,31 29.6,31 29.6,26.2 27.2,26.2 24.8,26.2 20.1,20 15.6,22.1
  pour Top (isolate 0.5, rank 2, no thermals): 40.3,14.7 40.3,19.2 43,19.2 43,10.2 47.1,10.2 47.1,22.3 36.2,22.3 36.2,14.7
  pour Route2 (rank 3, no thermals): -0.4,-0.8 51.8,-0.8 51.8,41.4 -0.4,41.4 -0.4,35.9 7.1,35.9 7.1,36.5 19.1,36.5 19.1,35.9 39.8,35.9 39.8,26.1 28.8,15.1 -0.4,15.1
  pour Route2: -0.5,15.6 28.5,15.6 39.2,26.3 39.2,35.3 19.1,35.3 19.1,34.3 7.1,34.3 7.1,35.3 -0.5,35.3
  pour Top (rank 2, no thermals): 2.6,14.1 8.1,14.1 8.1,10 2.6,10
  pour Route15 (isolate 0.5, rank 2, no thermals): -0.6,15.3 25.1,15.3 32,22.2 50.7,22.2 50.7,-0.3 -0.6,-0.3
  pour Bottom (isolate 0.5, rank 3, no thermals): -0.85,3.2 51.7,3.2 51.7,21.9 51.4,22.2 36,22.2 28.9,15.1 -0.47,15.1
  pour Top (no thermals): 20.7,11.1 24.4,11.1 24.4,14.4 20.7,14.4
  pour Top (no thermals): 25.1,11.1 28.7,11.1 28.7,14.4 25.1,14.4
  pour Top (no thermals): 9.4,11.5 13.7,11.5 13.7,15 9.4,15
  pour Top (no thermals): 15.1,11.3 19.4,11.3 19.4,15.1 15.1,15.1
  pour Top (no thermals): 30.5,11.5 34.6,11.5 34.6,14.9 30.5,14.9
  pour Bottom: 9.1,22 12.7,18.4 16.3,22 12.7,25.6
INHA  (via drill 0.3)
  Top 0.2: U2.37 11.9,26.72 11.9,27.2 12.2,27.5 16.1,27.5 16.3,27.3 v16.7,27.3 | v33.5,28.66 33.19,28.35 U9.30
  Bottom 0.2: v16.7,27.3 18.3,27.3 19.67,28.66 v33.5,28.66
INHB  (via drill 0.3)
  Top 0.2: U2.39 11.1,26.11 11.1,26.9 12.05,27.85 v17.3,27.85 | v32.74,29.42 32.17,28.85 U9.31
  Bottom 0.2: v17.3,27.85 18.36,27.85 19.93,29.42 v32.74,29.42
INHC  (via drill 0.3)
  Top 0.2: U2.41 10.2,25.59 10.2,26.5 11.9,28.2 16.4,28.2 v16.7,28.5 v16.7,28.51 | U9.32 31.95,29.35 32.19,29.59 32.19,29.65 32.53,30 v33.5,30
  Bottom 0.2: v16.7,28.51 18.51,28.51 20,30 v33.5,30
LED1  (via drill 0.35)
  Top 0.2: U9.47 24.95,33.75 v25.3,34.1 | v49.8,24.64 48.74,24.64 D2.2
  Bottom 0.2: v25.3,34.1 26,34.8 39.46,34.8 46.66,27.6 47.13,27.6 49.8,24.93 v49.8,24.64
LED2  (via drill 0.35)
  Top 0.2: U9.44 26.45,35.21 v26.72,35.48 | v49.8,26.65 48.75,26.65 D3.2
  Bottom 0.2: v26.72,35.48 27.02,35.18 39.59,35.18 46.82,27.95 47.27,27.95 48.58,26.65 v49.8,26.65
LED3  (via drill 0.3, 0.35)
  Top 0.2: U9.45 25.95,36.05 v25.9,36.1 | v49.8,28.7 D4.2
  Bottom 0.2: v25.9,36.1 27.1,36.1 27.67,35.53 39.74,35.53 46.57,28.7 v49.8,28.7
LPUART1_RX  (via drill 0.3)
  Top 0.2: U9.11 23.17,26.35 v22.73,25.91 | v20.4,25.66 19.66,26.4 19.2,26.4 18.3,27.3 18.3,28.4 14.4,32.3 12,32.3 9.97,34.33 J3.P7
  Bottom 0.2: v22.73,25.91 20.66,25.91 v20.4,25.66
LPUART1_TX  (via drill 0.3)
  Top 0.2: J3.P8 8.72,35.08 11.85,31.95 14.2,31.95 17.95,28.2 17.95,27.05 v19.3,25.7 | v22.53,26.67 22.71,26.85 U9.10
  Bottom 0.2: v19.3,25.7 20.27,26.67 v22.53,26.67
N$1
  Top 0.2: L1.2 27.95,21.45 | 27.95,21.45 C3.1 | 27.95,21.45 27.95,23.05 C2.1 27.95,23.15 U9.20
N$2
  Top 0.2: U9.5 23.05,29.35 22.18,30.23 X1.P$3 21.98,31.43 C37.1
N$3
  Top 0.2: C42.1 20.6,29.2 X1.P$1 21.25,28.55 22.51,28.55 22.81,28.85 U9.6
N$4
  Top 0.2: D4.1 R14.2
N$5
  Top 0.2: U2.48 7.64,23.2 R1.2
N$6
  Top 0.2: U2.44 9.05,24.62 C13.1
N$7
  Top 0.2: D3.1 R13.2
N$8  (via drill 0.35)
  Top 0.35: U2.45 8.06,24.9 8.06,25.65 7.75,25.96 C13.2 v6.7,26 | L2.PIN1 2.3,24.27 D1.C 4.38,26.2 v4.4,26.2
  Bottom 0.35: v6.7,26 6.7,26.2 v4.4,26.2
N$9  (via drill 0.3)
  Top 0.2: U2.1 7.94,21.2 7.7,21.2 v6.9,22 | v5.9,25.4 5.9,26.3 R3.2 R2.1
  Bottom 0.2: v6.9,22 6.9,24.4 v5.9,25.4
N$10
  Top 0.2: D2.1 R12.2
N$11  (via drill 0.3)
  Top 0.2: U10.7 39.05,26.75 39.2,26.6 40.9,26.6 41.3,27 R4.2 42.4,27 v42.9,26.5
  Bottom 0.2: v42.9,26.5 42.9,24.6 43.1,24.4 J2.P1
N$12  (via drill 0.3)
  Top 0.2: U10.6 38.55,26.55 39.1,26 R4.1 42.1,25.9 42.5,25.5 v43.6,25.5
  Bottom 0.2: v43.6,25.5 44,25.9 J2.P2
N$13  (via drill 0.3)
  Top 0.2: C31.2 8.25,18.1 v9,18.1 | v8.81,19.59 9.16,19.59 U2.5
  Bottom 0.2: v9,18.1 9,19.4 v8.81,19.59
N$14
  Top 0.2: U2.4 9.01,20.14 8.12,20.14 7.57,19.6 C33.1
N$15
  Top 0.2: U2.3 8.65,20.5 6.5,20.5 C33.2
N$16  (via drill 0.3)
  Top 0.25: L3.1 31.85,21.45 C10.1
  Top 0.3: U9.21 28.45,24.25 28.9,23.8 28.9,22 C11.1 C10.1 31.7,21.8 31.5,22 v31,22
N$21  (via drill 0.3)
  other vias: 32.3,8.4 31.7,8.4 31.1,8.4 33.5,8.4 34.1,8.4 32.9,8.4
  pour Top (no thermals): 30.5,10.9 34.8,10.9 34.8,7.2 32.1,7.2 32.1,7.8 30.5,7.8
  pour Bottom (no thermals): 30.4,10.9 34.8,10.9 34.8,7.2 30.4,7.2
N$22  (via drill 0.3)
  other vias: 17,8.3 16.4,8.3 15.8,8.3 17.6,8.3 18.2,8.3 18.8,8.3
  pour Top (no thermals): 15.1,10.9 19.5,10.9 19.5,7.1 16.8,7.1 16.8,7.7 15.1,7.7
  pour Bottom (no thermals): 15.1,10.9 19.5,10.9 19.5,7.2 15.1,7.2
N$23  (via drill 0.3)
  other vias: 11.1,8.3 10.5,8.3 9.9,8.3 11.7,8.3 12.9,8.3 12.3,8.3
  pour Top (no thermals): 9.3,10.8 14,10.8 14,7.1 11.1,7.1 11.1,7.7 9.3,7.7
  pour Bottom (no thermals): 9.3,10.8 14,10.8 14,7.1 9.3,7.1
NFAULT  (via drill 0.3)
  Top 0.2: U2.28 16.3,23.9 17.4,23.9 R8.1 17.7,24.87 v17.8,24.97 | U9.17 26.45,24.65 v25.7,23.9
  Bottom 0.2: v25.7,23.9 25.2,23.9 23.9,25.2 20.9,25.2 20.6,24.9 17.87,24.9 v17.8,24.97
NRST
  Top 0.2: U9.7 22.8,28.35 22.65,28.2 C15.1 19,28.2 14.55,32.65 12.15,32.65 11.22,33.58 J3.P6
SENSE_A  (via drill 0.3)
  Top 0.2: U2.25 17.26,22.75 20.75,22.75 v21.51,23.5 | v22.7,23.84 22.7,25.16 21.65,26.21 21.65,26.68 22.32,27.35 U9.9
  Bottom 0.2: v21.51,23.5 21.85,23.84 v22.7,23.84
SENSE_B
  Top 0.2: U9.8 23.05,27.85 22.95,27.75 22.23,27.75 21.29,26.82 21.29,26.07 22.1,25.26 22.1,23.3 21.07,22.27 18.55,22.27 17.58,21.3 17.32,21.3 U2.24
SENSE_C  (via drill 0.3)
  Top 0.2: U9.18 26.95,24.55 26.26,23.86 26.26,22.34 v26.11,22.2 | U2.23 16.96,20.95 17.73,20.95 18.7,21.92 21.22,21.92 21.6,22.3 v22,22.3
  Bottom 0.2: v22,22.3 22.1,22.2 v26.11,22.2
SHA  (via drill 0.35)
  Top 0.2: 9.55,6.15 9.7,6.3 | U2.9 9.6,17.2 v9.6,17 | v1.8,15.6 1.8,15.53 1.02,14.75 1.02,6.08 2.93,4.17 U3.SOURCE
  Bottom 0.2: v9.6,17 3.7,17 2.3,15.6 v1.8,15.6
  pour Top (rank 2, no thermals): 4.7,4.5 4.7,-0.1 14.1,-0.1 14.1,6.7 9.3,6.7 9.3,4.5
SHB
  Top 0.2: U2.16 15.62,17.34 18.55,17.34 20.2,15.7 20.2,7 19.5,6.3
  pour Top (no thermals): 14.8,6.7 19.9,6.7 19.9,4.3 24.3,4.3 24.3,-0.4 14.8,-0.4
SHC
  Top 0.2: U2.19 16.64,18.44 18.95,18.44 21.35,16.04 28.16,16.04 29.45,14.75 29.45,7.95 31,6.4
  pour Top (rank 2, no thermals): 25.2,4.3 25.2,-0.1 34.9,-0.1 34.9,6.7 30.7,6.7 30.7,4.3
SNA
  Top 0.2: U2.12 11.9,17.38 11.9,16.2 12.6,15.5 13.7,15.5 14,15.2 14,11.7 13.5,11.2 11.69,11.2 11.4,11.49 R5.2_KELVIN
SNB
  Top 0.2: U2.13 13.74,17.1 13.74,16.7 14.75,15.69 14.75,11.65 15.2,11.2 17,11.2 17.3,11.5 R6.2_KELVIN
SNC
  Top 0.2: U2.22 17.62,19.58 19.32,19.58 21.8,17.1 28.59,17.1 30.51,15.18 34.64,15.18 35.02,14.8 35.02,11.52 34.7,11.2 32.9,11.2 32.6,11.5 R7.2_KELVIN
SPA
  Top 0.2: U2.11 10.53,16.72 10.53,16.44 9.05,14.96 9.05,11.3 9.25,11.1 11.16,11.1 11.4,10.86 R5.1_KELVIN
SPB
  Top 0.2: U2.14 14.14,17.4 14.14,16.87 14.97,16.05 19.35,16.05 19.85,15.55 19.85,11.45 19.6,11.2 17.6,11.2 17.3,10.9 R6.1_KELVIN
SPC
  Top 0.2: U2.21 17.27,19.23 19.17,19.23 21.65,16.75 28.45,16.75 30.16,15.04 30.16,11.55 30.56,11.15 32.35,11.15 32.6,10.9 R7.1_KELVIN
SWCLK
  Top 0.2: U9.37 29.95,32.75 31.45,34.25 31.45,36.1 30.05,37.5 19.4,37.5 18.4,36.5 18.4,34.8 17.9,34.3 14.2,34.3 13.72,34.77 J3.P4
SWDIO
  Top 0.2: U9.36 31.35,31.35 31.8,31.8 31.8,36.3 30.2,37.9 17.3,37.9 16.23,36.83 J3.P2
SWO
  Top 0.2: U9.41 27.95,32.75 27.7,33 27.7,36.2 26.75,37.15 19.55,37.15 18.75,36.35 18.75,34.65 18.05,33.95 13.45,33.95 12.47,34.92 J3.P5
VBAT_SENSE
  Top 0.2: R10.1 33,25.2 R11.2 32.45,25.85 U9.25

### Text on the board
tPlace: Autoreiv / BLDC V1.1